# EAGLE design HoneyPI_Platine 2.01 (EAGLE 9.6.2)
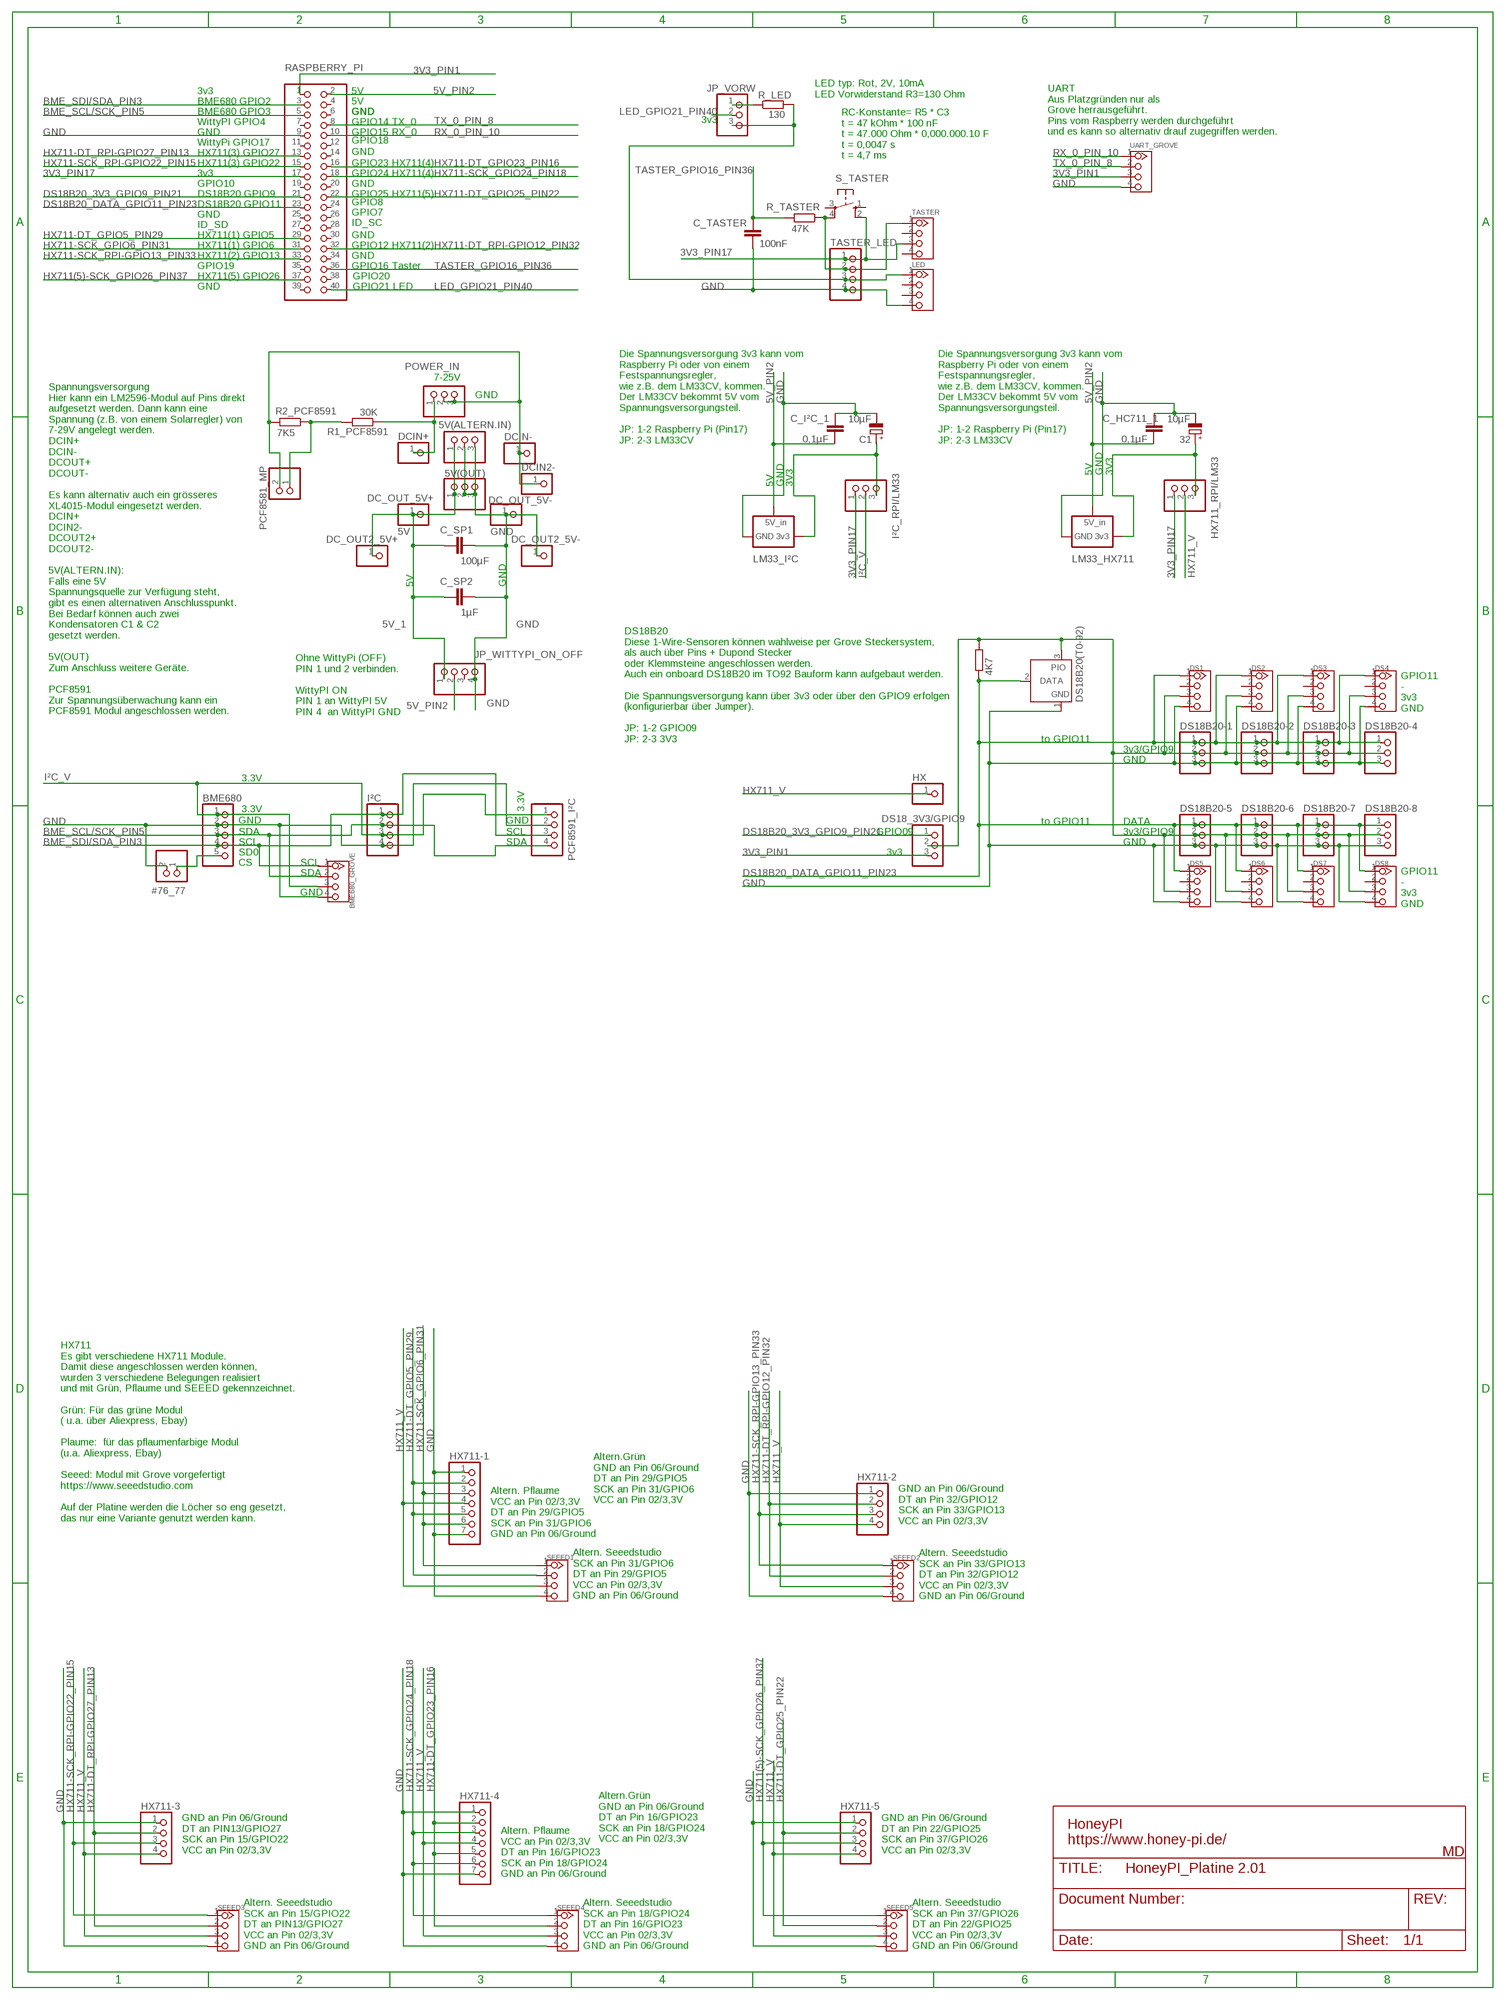
[diagram p0: schematic, sheet 1]

## Parts
5V(ALTERN.IN)  PINHD-1X3  [1X03]
5V(OUT)  PINHD-1X3  [1X03]
32  10µF  CPOL-EUE2-5  [E2-5]
#76_77  PINHD-1X2  [1X02]
BME680  PINHD-1X5  [1X05]
BME680_GROVE  TWIG-4P-2.0-2.0  [4P-2.0]
C1  10µF  CPOL-EUE2-5  [E2-5]
C_HC711_1  0,1µF  C2,5-3  [C2.5-3]
C_I²C_1  0,1µF  C2,5-3  [C2.5-3]
C_SP1  100µF  C2,5-3  [C2.5-3]
C_SP2  1µF  C2,5-3  [C2.5-3]
C_TASTER  100nF  C2,5-3  [C2.5-3]
DC_OUT2_5V+  PINHD-1X1  [1X01]
DC_OUT2_5V-  PINHD-1X1  [1X01]
DC_OUT_5V+  5V  PINHD-1X1  [1X01]
DC_OUT_5V-  GND  PINHD-1X1  [1X01]
DCIN2-  PINHD-1X1  [1X01]
DCIN+  PINHD-1X1  [1X01]
DCIN-  PINHD-1X1  [1X01]
DS1  TWIG-4P-2.0-2.0  [4P-2.0]
DS2  TWIG-4P-2.0-2.0  [4P-2.0]
DS3  TWIG-4P-2.0-2.0  [4P-2.0]
DS4  TWIG-4P-2.0-2.0  [4P-2.0]
DS5  TWIG-4P-2.0-2.0  [4P-2.0]
DS6  TWIG-4P-2.0-2.0  [4P-2.0]
DS7  TWIG-4P-2.0-2.0  [4P-2.0]
DS8  TWIG-4P-2.0-2.0  [4P-2.0]
DS18_3V3/GPIO9  PINHD-1X3  [1X03]
DS18B20(T0-92)  DS18b20  DS2405  [TO92-]
DS18B20-1  PINHD-1X3  [1X03]
DS18B20-2  PINHD-1X3  [1X03]
DS18B20-3  PINHD-1X3  [1X03]
DS18B20-4  PINHD-1X3  [1X03]
DS18B20-5  PINHD-1X3  [1X03]
DS18B20-6  PINHD-1X3  [1X03]
DS18B20-7  PINHD-1X3  [1X03]
DS18B20-8  PINHD-1X3  [1X03]
HX  PINHD-1X1  [1X01]
HX711-1  PINHD-1X7  [1X07]
HX711-2  PINHD-1X4  [1X04]
HX711-3  PINHD-1X4  [1X04]
HX711-4  PINHD-1X7  [1X07]
HX711-5  PINHD-1X4  [1X04]
HX711_RPI/LM33  PINHD-1X3  [1X03]
I²C  PINHD-1X4  [1X04]
I²C_RPI/LM33  PINHD-1X3  [1X03]
JP_VORW  PINHD-1X3  [1X03]
JP_WITTYPI_ON_OFF  PINHD-1X4  [1X04]
LED  TWIG-4P-2.0-2.0  [4P-2.0]
LM33_HX711  LM33CV  [337TS]
LM33_I²C  LM33CV  [337TS]
PCF8581_MP  PINHD-1X2  [1X02]
PCF8591_I²C  PINHD-1X4  [1X04]
POWER_IN  PINHD-1X3  [1X03]
R1_PCF8591  30K  R-EU_0204/7  [0204/7]
R2_PCF8591  7K5  R-EU_0204/7  [0204/7]
R_DS18B20  4K7  R-EU_0204/7  [0204/7]
R_LED  130  R-EU_0204/7  [0204/7]
R_TASTER  47K  R-EU_0204/7  [0204/7]
RASPBERRY_PI  PINHD-2X20  [2X20]
S_TASTER  10-XX  [B3F-10XX]
SEEED1  TWIG-4P-2.0-2.0  [4P-2.0]
SEEED2  TWIG-4P-2.0-2.0  [4P-2.0]
SEEED3  TWIG-4P-2.0-2.0  [4P-2.0]
SEEED4  TWIG-4P-2.0-2.0  [4P-2.0]
SEEED5  TWIG-4P-2.0-2.0  [4P-2.0]
TASTER  TWIG-4P-2.0-2.0  [4P-2.0]
TASTER_LED  PINHD-1X4  [1X04]
UART_GROVE  TWIG-4P-2.0-2.0  [4P-2.0]

## Nets
3V3 [Supply3v3]: DS1.3 DS2.3 DS3.3 DS4.3 DS5.3 DS6.3 DS7.3 DS8.3 DS18_3V3/GPIO9.2 DS18B20(T0-92).3(PIO) DS18B20-1.2 DS18B20-2.2 DS18B20-3.2 DS18B20-4.2 DS18B20-5.2 DS18B20-6.2 DS18B20-7.2 DS18B20-8.2 R_DS18B20.2
3V3_PIN1 [Supply3v3]: DS18_3V3/GPIO9.3 RASPBERRY_PI.1 UART_GROVE.3
3V3_PIN17 [Supply3v3]: HX711_RPI/LM33.1 I²C_RPI/LM33.1 RASPBERRY_PI.17 S_TASTER.2(S1) TASTER.3 TASTER_LED.1
5V_1 [Supply5v]: 5V(ALTERN.IN).1 5V(OUT).1 C_SP1.1 C_SP2.1 DC_OUT2_5V+.1 DC_OUT_5V+.1 JP_WITTYPI_ON_OFF.1
5V_PIN2 [Supply5v]: C_HC711_1.1 C_I²C_1.1 JP_WITTYPI_ON_OFF.2 LM33_HX711.1(5V) LM33_I²C.1(5V) RASPBERRY_PI.2
BME_SCL/SCK_PIN5: BME680.3 BME680_GROVE.2 I²C.2 PCF8591_I²C.4 RASPBERRY_PI.5
BME_SDI/SDA_PIN3: BME680.4 BME680_GROVE.1 I²C.1 PCF8591_I²C.3 RASPBERRY_PI.3
DS18B20_3V3_GPIO9_PIN21 [Supply3v3]: DS18_3V3/GPIO9.1 RASPBERRY_PI.21
DS18B20_DATA_GPIO11_PIN23: DS1.1 DS2.1 DS3.1 DS4.1 DS5.1 DS6.1 DS7.1 DS8.1 DS18B20(T0-92).2(DATA) DS18B20-1.1 DS18B20-2.1 DS18B20-3.1 DS18B20-4.1 DS18B20-5.1 DS18B20-6.1 DS18B20-7.1 DS18B20-8.1 R_DS18B20.1 RASPBERRY_PI.23
GND [Supply5v]: 5V(ALTERN.IN).2 5V(ALTERN.IN).3 5V(OUT).2 5V(OUT).3 32.- #76_77.2 BME680.2 BME680_GROVE.4 C1.- C_HC711_1.2 C_I²C_1.2 C_SP1.2 C_SP2.2 C_TASTER.1 DC_OUT2_5V-.1 DC_OUT_5V-.1 DS1.4 DS2.4 DS3.4 DS4.4 DS5.4 DS6.4 DS7.4 DS8.4 DS18B20(T0-92).1(GND) DS18B20-1.3 DS18B20-2.3 DS18B20-3.3 DS18B20-4.3 DS18B20-5.3 DS18B20-6.3 DS18B20-7.3 DS18B20-8.3 HX711-1.1 HX711-1.7 HX711-2.1 HX711-3.1 HX711-4.1 HX711-4.7 HX711-5.1 I²C.4 JP_WITTYPI_ON_OFF.4 LED.4 LM33_HX711.2(GND) LM33_I²C.2(GND) PCF8591_I²C.2 RASPBERRY_PI.9 SEEED1.4 SEEED2.4 SEEED3.4 SEEED4.4 SEEED5.4 TASTER_LED.4 UART_GROVE.4
HX711(5)-SCK_GPIO26_PIN37: HX711-5.3 RASPBERRY_PI.37 SEEED5.1
HX711-DT_GPIO5_PIN29: HX711-1.2 HX711-1.5 RASPBERRY_PI.29 SEEED1.2
HX711-DT_GPIO23_PIN16: HX711-4.2 HX711-4.5 RASPBERRY_PI.16 SEEED4.2
HX711-DT_GPIO25_PIN22: HX711-5.2 RASPBERRY_PI.22 SEEED5.2
HX711-DT_RPI-GPIO12_PIN32: HX711-2.2 RASPBERRY_PI.32 SEEED2.2
HX711-DT_RPI-GPIO27_PIN13: HX711-3.2 RASPBERRY_PI.13 SEEED3.2
HX711-SCK_GPIO6_PIN31: HX711-1.3 HX711-1.6 RASPBERRY_PI.31 SEEED1.1
HX711-SCK_GPIO24_PIN18: HX711-4.3 HX711-4.6 RASPBERRY_PI.18 SEEED4.1
HX711-SCK_RPI-GPIO13_PIN33: HX711-2.3 RASPBERRY_PI.33 SEEED2.1
HX711-SCK_RPI-GPIO22_PIN15: HX711-3.3 RASPBERRY_PI.15 SEEED3.1
HX711_V [Supply5v]: HX711-1.4 HX711-2.4 HX711-3.4 HX711-4.4 HX711-5.4 HX711_RPI/LM33.2 HX.1 SEEED1.3 SEEED2.3 SEEED3.3 SEEED4.3 SEEED5.3
I²C_V [Supply3v3]: BME680.1 BME680_GROVE.3 I²C.3 I²C_RPI/LM33.2 PCF8591_I²C.1
LED_2: JP_VORW.3 LED.1 R_LED.2 TASTER_LED.3
LED_GPIO21_PIN40 [Supply3v3]: JP_VORW.2 RASPBERRY_PI.40
N$1: DCIN2-.1 DCIN-.1 PCF8581_MP.2 POWER_IN.2 POWER_IN.3 R2_PCF8591.2
N$2: C1.+ I²C_RPI/LM33.3 LM33_I²C.3(OUT3V3)
N$3: R_TASTER.1 S_TASTER.4(P1) TASTER.1 TASTER_LED.2
N$4: 32.+ HX711_RPI/LM33.3 LM33_HX711.3(OUT3V3)
N$6: PCF8581_MP.1 R1_PCF8591.2 R2_PCF8591.1
N$8: #76_77.1 BME680.5
N$10: JP_VORW.1 R_LED.1
N$45 [Supply5v]: DCIN+.1 POWER_IN.1 R1_PCF8591.1
RX_0_PIN_10: RASPBERRY_PI.10 UART_GROVE.1
TASTER_GPIO16_PIN36: C_TASTER.2 R_TASTER.2 RASPBERRY_PI.36
TX_0_PIN_8: RASPBERRY_PI.8 UART_GROVE.2
Unconnected: DS1.2 DS2.2 DS3.2 DS4.2 DS5.2 DS6.2 DS7.2 DS8.2 JP_WITTYPI_ON_OFF.3 LED.2 LED.3 RASPBERRY_PI.4 RASPBERRY_PI.6 RASPBERRY_PI.7 RASPBERRY_PI.11 RASPBERRY_PI.12 RASPBERRY_PI.14 RASPBERRY_PI.19 RASPBERRY_PI.20 RASPBERRY_PI.24 RASPBERRY_PI.25 RASPBERRY_PI.26 RASPBERRY_PI.27 RASPBERRY_PI.28 RASPBERRY_PI.30 RASPBERRY_PI.34 RASPBERRY_PI.35 RASPBERRY_PI.38 RASPBERRY_PI.39 S_TASTER.1(S) S_TASTER.3(P) TASTER.2 TASTER.4

## Notes on the sheet
- 3v3 | 5V
- LED typ: Rot, 2V, 10mA
  LED Vorwiderstand R3=130 Ohm
- BME680 GPIO2 | 5V
- BME680 GPIO3 | GND | GND
- WittyPI GPIO4 | GPIO14 TX_0 | 3v3
- GND | GPIO15 RX_0
- WittyPi GPIO17 | GPIO18
- UART
  Aus Platzgründen nur als
  Grove herrausgeführt. 
  Pins vom Raspberry werden durchgeführt
  und es kann so alternativ drauf zugegriffen werden.
- HX711(3) GPIO27 | GND
- HX711(3) GPIO22 | GPIO23 HX711(4)
- RC-Konstante= R5 * C3
  t = 47 kOhm * 100 nF    
  t = 47.000 Ohm * 0,000.000.10 F
  t = 0,0047 s
  t = 4,7 ms
- 3v3 | GPIO24 HX711(4)
- GPIO10 | GND
- DS18B20 GPIO9 | GPIO25 HX711(5)
- DS18B20 GPIO11 | GPIO8
- GND | GPIO7
- ID_SD | ID_SC
- HX711(1) GPIO5 | GND
- HX711(1) GPIO6 | GPIO12 HX711(2)
- HX711(2) GPIO13 | GND
- GPIO19 | GPIO16 Taster
- HX711(5) GPIO26 | GPIO20
- GND | GPIO21 LED
- 7-25V
- GND
- Die Spannungsversorgung 3v3 kann vom
  Raspberry Pi oder von einem 
  Festspannungsregler, 
  wie z.B. dem LM33CV, kommen.
  Der LM33CV bekommt 5V vom
  Spannungsversorgungsteil.
  
  JP: 1-2 Raspberry Pi (Pin17)
  JP: 2-3 LM33CV
- Die Spannungsversorgung 3v3 kann vom
  Raspberry Pi oder von einem 
  Festspannungsregler, 
  wie z.B. dem LM33CV, kommen.
  Der LM33CV bekommt 5V vom
  Spannungsversorgungsteil.
  
  JP: 1-2 Raspberry Pi (Pin17)
  JP: 2-3 LM33CV
- 5V | GND | 3V3
- 5V | GND | 3V3
- 5V | GND
- GPIO11
  -
  3v3
  GND
- Spannungsversorgung
  Hier kann ein LM2596-Modul auf Pins direkt
  aufgesetzt werden. Dann kann eine
  Spannung (z.B. von einem Solarregler) von
  7-29V angelegt werden.
  DCIN+
  DCIN-
  DCOUT+
  DCOUT-
  
  Es kann alternativ auch ein grösseres
  XL4015-Modul eingesetzt werden. 
  DCIN+
  DCIN2-
  DCOUT2+
  DCOUT2-
  
  5V(ALTERN.IN):
  Falls eine 5V
  Spannungsquelle zur Verfügung steht,
  gibt es einen alternativen Anschlusspunkt.
  Bei Bedarf können auch zwei
  Kondensatoren C1 & C2
  gesetzt werden.    
  
  5V(OUT)
  Zum Anschluss weitere Geräte.
  
  PCF8591
  Zur Spannungsüberwachung kann ein
  PCF8591 Modul angeschlossen werden.
- Ohne WittyPi (OFF)
  PIN 1 und 2 verbinden.
  
  WittyPI ON
  PIN 1 an WittyPI 5V 
  PIN 4  an WittyPI GND
- DS18B20
  Diese 1-Wire-Sensoren können wahlweise per Grove Steckersystem,
  als auch über Pins + Dupond Stecker
  oder Klemmsteine angeschlossen werden.
  Auch ein onboard DS18B20 im TO92 Bauform kann aufgebaut werden. 
  
  Die Spannungsversorgung kann über 3v3 oder über den GPIO9 erfolgen
  (konfigurierbar über Jumper).
  
  JP: 1-2 GPIO09
  JP: 2-3 3V3
- to GPIO11
- 3v3/GPIO9
- GND
- 3.3V
- 3.3V | 3.3V
- GND | GND | to GPIO11 | DATA
- SDA | SCL | GPIO09 | 3v3/GPIO9
- SCL | SDA | GND
- SD0 | 3v3
- CS | SCL
- SDA
- GND
- GPIO11
  -
  3v3
  GND
- Altern.Grün
  GND an Pin 06/Ground
  DT an Pin 29/GPIO5
  SCK an Pin 31/GPIO6
  VCC an Pin 02/3,3V
- HX711
  Es gibt verschiedene HX711 Module.
  Damit diese angeschlossen werden können,
  wurden 3 verschiedene Belegungen realisiert
  und mit Grün, Pflaume und SEEED gekennzeichnet.
  
  Grün: Für das grüne Modul 
  ( u.a. über Aliexpress, Ebay)
  
  Plaume:  für das pflaumenfarbige Modul 
  (u.a. Aliexpress, Ebay) 
  
  Seeed: Modul mit Grove vorgefertigt
  https://www.seeedstudio.com
  
  Auf der Platine werden die Löcher so eng gesetzt,
  das nur eine Variante genutzt werden kann.
- GND an Pin 06/Ground
  DT an Pin 32/GPIO12
  SCK an Pin 33/GPIO13
  VCC an Pin 02/3,3V
- Altern. Pflaume
  VCC an Pin 02/3,3V
  DT an Pin 29/GPIO5
  SCK an Pin 31/GPIO6
  GND an Pin 06/Ground
- Altern. Seeedstudio
  SCK an Pin 31/GPIO6
  DT an Pin 29/GPIO5
  VCC an Pin 02/3,3V
  GND an Pin 06/Ground
- Altern. Seeedstudio
  SCK an Pin 33/GPIO13
  DT an Pin 32/GPIO12
  VCC an Pin 02/3,3V
  GND an Pin 06/Ground
- Altern.Grün
  GND an Pin 06/Ground
  DT an Pin 16/GPIO23
  SCK an Pin 18/GPIO24
  VCC an Pin 02/3,3V
- HoneyPI
  https://www.honey-pi.de/
- GND an Pin 06/Ground
  DT an PIN13/GPIO27
  SCK an Pin 15/GPIO22
  VCC an Pin 02/3,3V
- GND an Pin 06/Ground
  DT an Pin 22/GPIO25
  SCK an Pin 37/GPIO26
  VCC an Pin 02/3,3V
- MD
- Altern. Pflaume
  VCC an Pin 02/3,3V
  DT an Pin 16/GPIO23
  SCK an Pin 18/GPIO24
  GND an Pin 06/Ground
- Altern. Seeedstudio
  SCK an Pin 15/GPIO22
  DT an PIN13/GPIO27
  VCC an Pin 02/3,3V
  GND an Pin 06/Ground
- Altern. Seeedstudio
  SCK an Pin 18/GPIO24
  DT an Pin 16/GPIO23
  VCC an Pin 02/3,3V
  GND an Pin 06/Ground
- Altern. Seeedstudio
  SCK an Pin 37/GPIO26
  DT an Pin 22/GPIO25
  VCC an Pin 02/3,3V
  GND an Pin 06/Ground

## Library data of the parts
5V(ALTERN.IN) 5V(OUT) DS18_3V3/GPIO9 DS18B20-1-DS18B20-8 HX711_RPI/LM33 I²C_RPI/LM33 JP_VORW POWER_IN = pinhead:PINHD-1X3: PIN HEADER
32 C1 = rcl:CPOL-EU: POLARIZED CAPACITOR, European symbol; SPICEPREFIX: C
#76_77 PCF8581_MP = pinhead:PINHD-1X2: PIN HEADER
BME680 = pinhead:PINHD-1X5: PIN HEADER
BME680_GROVE DS1-DS8 LED SEEED1-SEEED5 TASTER UART_GROVE = Connector:TWIG-4P-2.0: Grove Stecker RM 2mm 4Pol
C_HC711_1 C_I²C_1 C_SP1 C_SP2 C_TASTER = capacitor-wima:C: CAPACITOR
DC_OUT2_5V+ DC_OUT2_5V- DC_OUT_5V+ DC_OUT_5V- DCIN2- DCIN+ DCIN- HX = pinhead:PINHD-1X1: PIN HEADER
DS18B20(T0-92) = maxim:DS2405: Addressable Switch DALLAS Semiconductor; MF: DALLAS SEMICONDUCTOR; MPN: DS2405; OC_FARNELL: 1188025; OC_NEWARK: 06F4645
HX711-1 HX711-4 = pinhead:PINHD-1X7: PIN HEADER
HX711-2 HX711-3 HX711-5 I²C JP_WITTYPI_ON_OFF PCF8591_I²C TASTER_LED = pinhead:PINHD-1X4: PIN HEADER
LM33_HX711 LM33_I²C = LM33cv:LM33CV: VOLTAGE REGULATOR
R1_PCF8591 R2_PCF8591 R_DS18B20 R_LED R_TASTER = rcl:R-EU_: RESISTOR, European symbol; SPICEPREFIX: R
RASPBERRY_PI = pinhead:PINHD-2X20: PIN HEADER
S_TASTER = switch-omron:10-XX: OMRON SWITCH; MPN: B3F-1000; OC_FARNELL: 176432; OC_NEWARK: 36M3542

## Net classes
0 Signal: width 0.152 mm, clearance 0.305 mm
1 Supply3v3: width 0.203 mm, clearance 0.305 mm
2 Supply5v: width 0.406 mm, clearance 0.305 mm

## Board
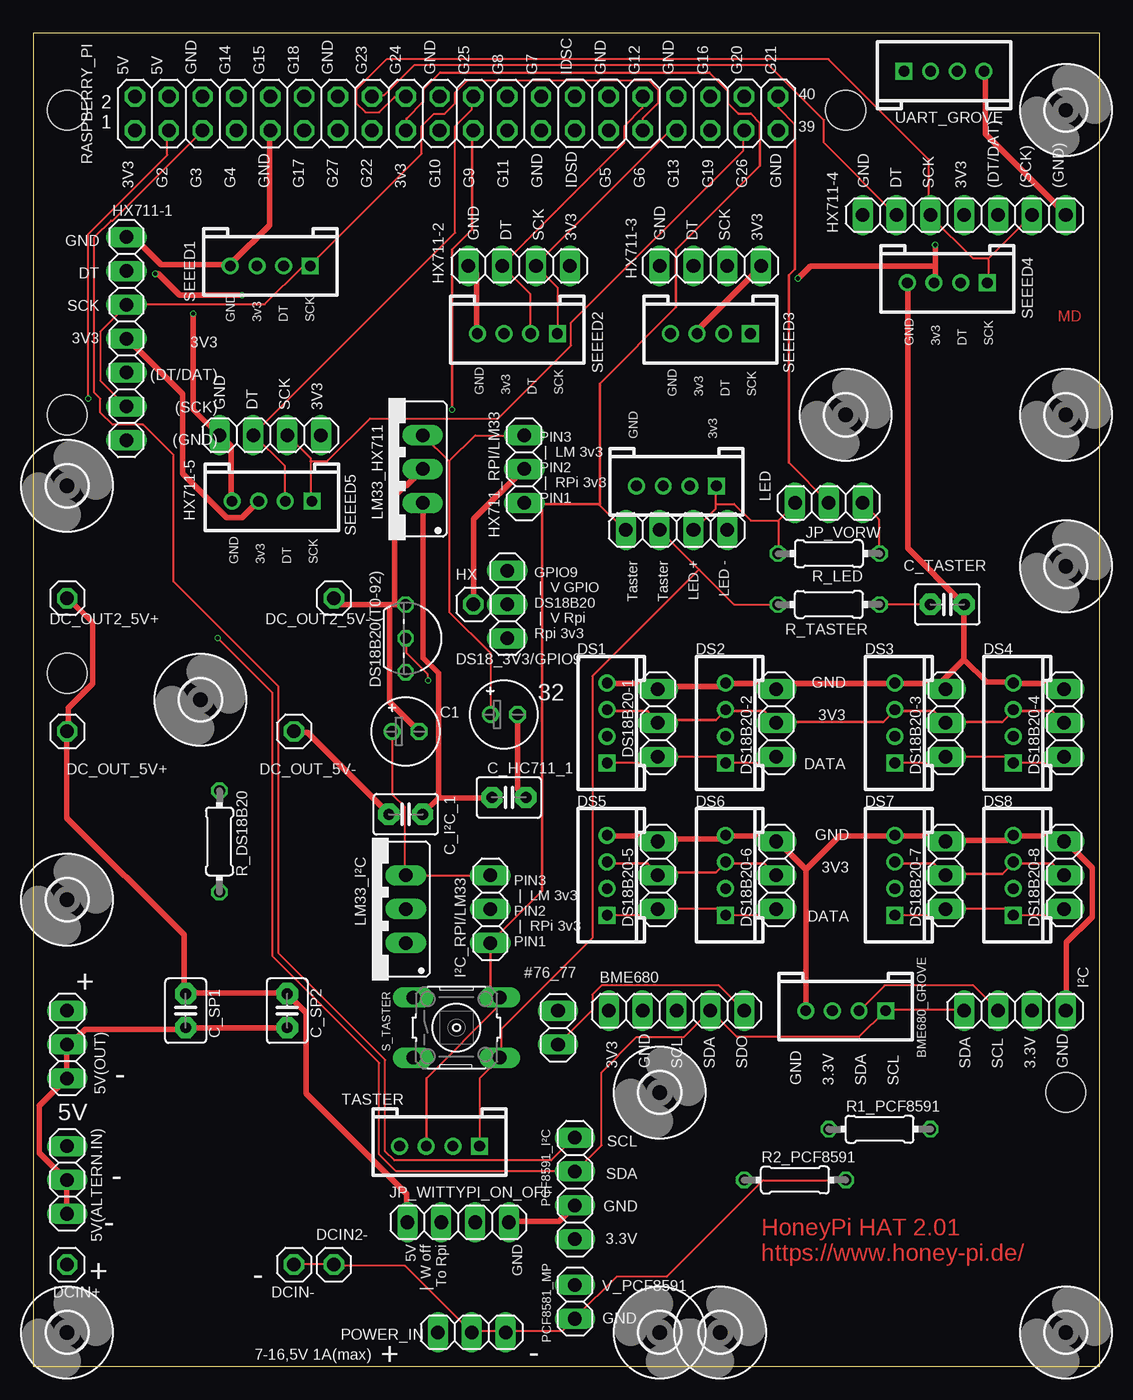
[diagram p1: board, top side]
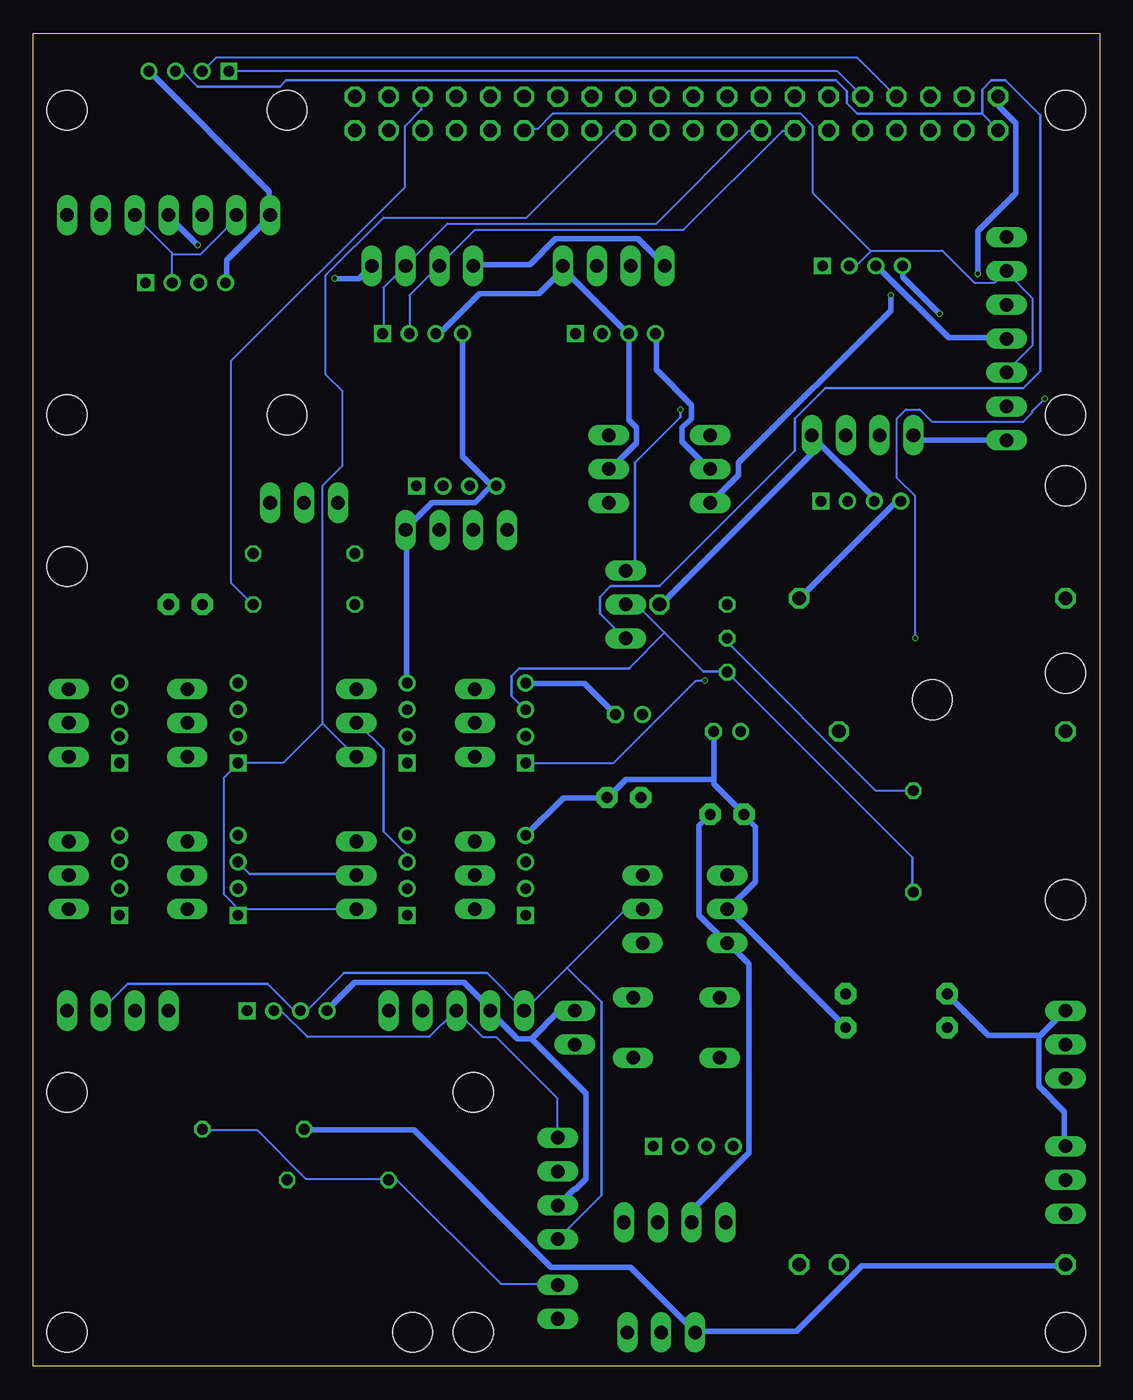
[diagram p2: board, bottom side, seen from below]

Size 80 x 100 mm. Coordinates in mm from the lower left corner, seen from the top.
Outline: 0,0 80,0 80,100 0,100 0,0
Copper layers (1*16): Top 0.035559375mm / dielectric 1.6mm / Bottom 0.035559375mm
Design rules "jlcpcb2layer": minimum track width 5mil, minimum drill 12mil, track to track 5mil, track to pad 5mil, pad to pad 5mil, via to via 5mil, smd to smd 5mil, copper to edge 8mil, drill to drill 6mil, minimum pad ring 5mil, minimum via ring 3mil, stop-mask expansion 2.5mil, vias tented up to drill 0mil, thermal gap 10mil
Holes 3 mm at 2.54,94.23 2.54,71.37 60.96,94.23 77.47,20.54 2.54,52

### Footprints (pad centres in the part's own frame; a part is rotated, then mirrored left to right if it is on the bottom)
1X03 = drill 1.016 long: 1 -2.54,0; 2 0,0; 3 2.54,0
E2-5 = drill 0.813 pad 1.27: + -1.016,0 | drill 0.813 pad 1.27 octagon: - 1.016,0
1X02 = drill 1.016 long: 1 -1.27,0; 2 1.27,0
1X05 = drill 1.016 long: 1 -5.08,0; 2 -2.54,0; 3 0,0; 4 2.54,0; 5 5.08,0
4P-2.0 = drill 0.8 pad 1.27 square: 1 -3,0 | drill 0.8 pad 1.27: 2 -1,0; 3 1,0; 4 3,0
C2.5-3 = drill 0.813 pad 1.6 octagon: 1 -1.27,0; 2 1.27,0
1X01 = drill 1.016 octagon: 1 0,0
TO92- = drill 0.813 octagon: 1 -2.54,0; 2 0,0; 3 2.54,0
1X07 = drill 1.016 long: 1 -7.62,0; 2 -5.08,0; 3 -2.54,0; 4 0,0; 5 2.54,0; 6 5.08,0; 7 7.62,0
1X04 = drill 1.016 long: 1 -3.81,0; 2 -1.27,0; 3 1.27,0; 4 3.81,0
337TS = drill 1.016 long: 1 -2.54,-2.54; 2 0,-2.54; 3 2.54,-2.54
0204/7 = drill 0.813 octagon: 1 -3.81,0; 2 3.81,0
2X20 = drill 1.016 octagon: 1 -24.13,-1.27; 2 -24.13,1.27; 3 -21.59,-1.27; 4 -21.59,1.27; 5 -19.05,-1.27; 6 -19.05,1.27; 7 -16.51,-1.27; 8 -16.51,1.27; 9 -13.97,-1.27; 10 -13.97,1.27; 11 -11.43,-1.27; 12 -11.43,1.27; 13 -8.89,-1.27; 14 -8.89,1.27; 15 -6.35,-1.27; 16 -6.35,1.27; 17 -3.81,-1.27; 18 -3.81,1.27; 19 -1.27,-1.27; 20 -1.27,1.27; 21 1.27,-1.27; 22 1.27,1.27; 23 3.81,-1.27; 24 3.81,1.27; 25 6.35,-1.27; 26 6.35,1.27; 27 8.89,-1.27; 28 8.89,1.27; 29 11.43,-1.27; 30 11.43,1.27; 31 13.97,-1.27; 32 13.97,1.27; 33 16.51,-1.27; 34 16.51,1.27; 35 19.05,-1.27; 36 19.05,1.27; 37 21.59,-1.27; 38 21.59,1.27; 39 24.13,-1.27; 40 24.13,1.27
B3F-10XX = drill 1.016 long: 1 -3.251,2.261; 2 3.251,2.261; 3 -3.251,-2.261; 4 3.251,-2.261
3,0 = hole 3: 0,0

### Placement (x,y rotation side)
5V(ALTERN.IN)  2.54,13.97 270 top
5V(OUT)  2.54,24.13 270 top
32  35.31,48.9 0 top
#76_77  39.37,25.4 90 top
BME680  48.26,26.67 0 top
BME680_GROVE  60.96,26.67 180 top
C1  27.94,47.62 0 top
C_HC711_1  35.69,42.67 0 top
C_I²C_1  27.94,41.4 180 top
C_SP1  11.43,26.67 270 top
C_SP2  19.05,26.67 270 top
C_TASTER  68.58,57.15 180 top
DC_OUT2_5V+  2.54,57.62 0 top
DC_OUT2_5V-  22.54,57.62 0 top
DC_OUT_5V+  2.54,47.62 0 top
DC_OUT_5V-  19.56,47.62 0 top
DCIN2-  22.54,7.62 0 top
DCIN+  2.54,7.62 0 top
DCIN-  19.56,7.62 0 top
DS1  43.05,48.26 90 top
DS2  51.94,48.26 90 top
DS3  64.64,48.26 90 top
DS4  73.53,48.26 90 top
DS5  43.05,36.83 90 top
DS6  51.94,36.83 90 top
DS7  64.64,36.83 90 top
DS8  73.53,36.83 90 top
DS18_3V3/GPIO9  35.56,57.15 270 top
DS18B20(T0-92)  27.94,54.61 270 top
DS18B20-1  46.86,48.26 90 top
DS18B20-2  55.75,48.26 90 top
DS18B20-3  68.45,48.26 90 top
DS18B20-4  77.34,48.26 90 top
DS18B20-5  46.86,36.83 90 top
DS18B20-6  55.75,36.83 90 top
DS18B20-7  68.45,36.83 90 top
DS18B20-8  77.34,36.83 90 top
HX  33.02,57.15 0 top
HX711-1  6.99,77.09 270 top
HX711-2  36.45,82.55 0 top
HX711-3  50.8,82.55 0 top
HX711-4  69.85,86.36 0 top
HX711-5  17.78,69.85 0 top
HX711_RPI/LM33  36.83,67.31 90 top
I²C  73.66,26.67 0 top
I²C_RPI/LM33  34.29,34.29 90 top
JP_VORW  59.69,64.77 180 top
JP_WITTYPI_ON_OFF  31.88,10.79 0 top
LED  48.26,66.04 180 top
LM33_HX711  26.67,67.31 90 top
LM33_I²C  25.4,34.29 90 top
PCF8581_MP  40.64,4.83 270 top
PCF8591_I²C  40.64,13.34 90 top
POWER_IN  32.89,2.54 0 top
R1_PCF8591  63.5,17.78 0 top
R2_PCF8591  57.15,13.97 0 top
R_DS18B20  13.97,39.37 270 top
R_LED  59.69,60.96 180 top
R_TASTER  59.69,57.15 0 top
RASPBERRY_PI  31.75,93.98 0 top
S_TASTER  31.75,25.4 0 top
SEEED1  17.78,82.55 180 top
SEEED2  36.32,77.47 180 top
SEEED3  50.8,77.47 180 top
SEEED4  68.58,81.28 180 top
SEEED5  17.91,64.9 180 top
TASTER  30.48,16.51 180 top
TASTER_LED  48.26,62.74 0 top
U$1  [3,0]  77.47,71.37 0 top
U$2  [3,0]  51.54,2.54 0 top
U$3  [3,0]  77.47,2.54 0 top
U$4  [3,0]  2.54,2.54 0 top
U$5  [3,0]  46.99,20.54 0 top
U$6  [3,0]  46.99,2.54 270 top
U$7  [3,0]  60.96,71.37 0 top
U$8  [3,0]  2.54,66.04 0 top
U$9  [3,0]  2.54,35 0 top
U$10  [3,0]  77.47,60 0 top
U$11  [3,0]  12.54,50 0 top
U$12  [3,0]  77.47,94.23 0 top
UART_GROVE  68.33,97.16 0 top

### Tracks (layer width: path | path; a pad name or v marks a point on that pad's centre or on a via)
3V3
  Top 0.203: DS5.3 43.09,37.72 46.06,37.72 46.86,36.92 DS18B20-5.2 46.86,37.03 51.21,37.03 51.89,37.72 DS6.3 52.01,37.72 54.86,37.72 DS18B20-6.2 | DS7.3 64.69,37.72 67.55,37.72 68.35,36.92 DS18B20-7.2 68.47,36.92 72.69,36.92 73.5,37.72 DS8.3 73.61,37.72 76.47,37.72 77.27,36.92 DS18B20-8.2 | DS1.3 43.09,49.15 46.06,49.15 46.86,48.35 DS18B20-1.2 46.86,48.46 51.21,48.46 51.89,49.15 DS2.3 52.01,49.15 54.86,49.15 DS18B20-2.2 55.78,48.35 63.78,48.35 64.58,49.15 DS3.3 64.69,49.15 67.55,49.15 68.35,48.35 DS18B20-3.2 68.47,48.35 72.69,48.35 73.5,49.15 DS4.3 73.61,49.15 76.47,49.15 77.27,48.35 DS18B20-4.2
  Bottom 0.203: R_DS18B20.2 14.06,35.66 14.06,38.18 27.89,52.01 DS18B20(T0-92).3 28,52.12 29.72,52.12 32.63,55.03 | DS18_3V3/GPIO9.2 34.75,57.15 32.63,55.03 | DS18B20-6.2 55.78,36.92 63.78,36.92 64.58,37.72 DS7.3 | DS6.3 52.01,37.83 52.01,38.41 53.72,40.12 53.72,46.29 55.66,48.23 DS18B20-2.2 | 32.63,55.03 35.32,52.35 43.55,52.35 44.12,51.78 44.12,50.29 43.09,49.26 DS1.3
3V3_PIN1
  Bottom 0.203: UART_GROVE.3 68.81,97.16 67.67,96.01 61.49,96.01 61.04,96.47 19.77,96.47 18.97,95.67 18.97,94.75 18.17,93.95 8.8,93.95 | 8.8,93.95 7.66,92.81 RASPBERRY_PI.1 | 8.8,93.95 8.8,95.78 8.12,96.47 7.09,96.47 4.46,93.84 4.46,74.64 5.71,73.38 20.57,73.38 22.86,71.09 22.86,68.69 33.03,58.52 36.69,58.52 37.49,57.72 37.49,56.46 35.66,54.63 DS18_3V3/GPIO9.3
3V3_PIN17
  Top 0.203: 34.98,27.66 34.98,27.09 29.49,21.6 29.49,16.57 TASTER.3 | 34.98,27.66 34.29,28.35 I²C_RPI/LM33.1 34.29,31.77 38.18,35.66 38.18,64.69 | 34.98,27.66 S_TASTER.2 | 38.18,64.69 42.41,64.69 42.46,64.64 | 38.18,64.69 36.92,64.69 HX711_RPI/LM33.1 38.18,64.69 | 42.46,64.64 44.35,62.75 TASTER_LED.1 | RASPBERRY_PI.17 28,92.81 28,93.61 29.26,94.87 29.26,95.78 30.52,97.04 50.75,97.04 52.12,95.67 52.12,94.75 52.92,93.95 53.84,93.95 54.52,93.27 54.52,90.07 48.23,83.78 48.23,79.44 42.52,73.72 42.52,64.69 42.46,64.64
5V_1
  Top 0.406: DC_OUT2_5V+.1 2.63,57.61 4.46,55.78 4.46,51.21 2.63,49.38 2.63,47.66 DC_OUT_5V+.1 2.52,47.43 2.52,41.15 11.32,32.35 11.32,28.12 C_SP1.1 11.43,28 18.86,28 C_SP2.1 19.09,27.89 20.46,26.52 20.46,20.46 28,12.92 28,10.86 JP_WITTYPI_ON_OFF.1
  Bottom 0.406: 4.57,24.69 4.57,21.03 2.63,19.09 2.63,16.57 5V(ALTERN.IN).1 | 4.57,24.69 2.63,26.63 5V(OUT).1 | 4.57,24.69 4.69,24.8 8.34,24.8 11.43,27.89 C_SP1.1
5V_PIN2  (via drill 0.3)
  Top 0.406: 30.4,42.63 30.4,52.01 29.26,53.15 29.26,64.69 LM33_HX711.1 | 30.4,42.63 29.26,41.49 C_I²C_1.1 | v9.14,81.95 9.37,81.95 10.97,80.35 v15.66,80.35 | 30.4,42.63 34.4,42.63 C_HC711_1.1
  Bottom 0.406: C_I²C_1.1 29.26,41.38 30.06,40.58 30.06,33.83 28,31.77 LM33_I²C.1 27.77,31.66 26.29,30.18 26.29,16 30.52,11.77 30.52,10.86 JP_WITTYPI_ON_OFF.2 | v9.14,81.95 9.14,85.15 6.29,88.01 6.29,93.27 7.54,94.53 7.54,95.21 RASPBERRY_PI.2 | v15.66,80.35 15.66,79.21 27.09,67.78 27.09,66.86 29.15,64.81 LM33_HX711.1
BME_SCL/SCK_PIN5
  Top 0.152: BME680_GROVE.2 62.06,26.75 63.89,28.57 70.52,28.57 72.35,26.75 I²C.2 | RASPBERRY_PI.5 5.94,85.95 5.83,85.95 4.57,84.7 4.57,73.04 5.03,72.58 5.03,71.55 5.94,70.64 8.23,70.64 10.52,68.35 10.52,58.86 18.4,50.98 18.4,30.98 26.4,22.97 26.4,16.12 27.09,15.43 38.86,15.43 40.58,17.14 PCF8591_I²C.4
  Bottom 0.152: PCF8591_I²C.4 40.69,17.14 40.69,20.12 45.26,24.69 46.29,24.69 48.23,26.63 BME680.3 48.35,26.63 50.29,24.69 59.44,24.69 61.38,26.63 61.95,26.63 BME680_GROVE.2
BME_SDI/SDA_PIN3  (via drill 0.3)
  Top 0.152: I²C.1 69.84,26.75 64.01,26.75 BME680_GROVE.1 63.89,26.63 61.95,24.69 52.81,24.69 50.86,26.63 BME680.4 50.75,26.63 48.81,24.69 45.26,24.69 42.63,22.06 42.63,16.57 40.69,14.63 PCF8591_I²C.3 40.58,14.63 27.2,14.63 25.95,15.89 25.95,22.75 17.95,30.75 17.95,50.52 v13.83,54.63 | v4.12,72.58 4.12,84.92 10.06,90.87 10.06,92.7 RASPBERRY_PI.3
  Bottom 0.152: v4.12,72.58 5.03,71.67 5.03,71.55 5.71,70.87 12.57,70.87 13.49,71.78 14.52,71.78 15.2,71.09 15.2,66.64 13.83,65.27 v13.83,54.63
DS18B20_3V3_GPIO9_PIN21  (via drill 0.3)
  Top 0.203: v31.43,71.78 31.43,83.78 32.92,85.27 32.92,92.7 RASPBERRY_PI.21
  Bottom 0.203: v31.43,71.78 31.43,71.21 34.86,67.78 34.86,60.47 35.55,59.78 DS18_3V3/GPIO9.1
DS18B20_DATA_GPIO11_PIN23  (via drill 0.3)
  Top 0.152: DS5.1 43.09,33.83 46.41,33.83 DS18B20-5.1 51.44,34.29 51.89,33.83 DS6.1 52.01,33.83 55.21,33.83 55.66,34.29 DS18B20-6.1 | DS7.1 64.69,33.83 67.89,33.83 68.35,34.29 DS18B20-7.1 73.04,34.29 73.5,33.83 DS8.1 73.61,33.83 76.81,33.83 77.27,34.29 DS18B20-8.1 | DS3.1 64.69,45.26 67.89,45.26 68.35,45.72 DS18B20-3.1 73.04,45.72 73.5,45.26 DS4.1 73.61,45.26 76.81,45.26 77.27,45.72 DS18B20-4.1 | DS1.1 43.09,45.26 46.41,45.26 DS18B20-1.1 51.44,45.72 51.89,45.26 DS2.1 52.01,45.26 55.21,45.26 55.66,45.72 DS18B20-2.1 | v29.6,51.44 29.6,51.89 28,53.49 28,54.52 DS18B20(T0-92).2
  Bottom 0.152: DS18B20-6.1 64.12,34.29 64.35,34.06 | 64.35,34.06 64.58,33.83 DS7.1 64.35,34.06 | R_DS18B20.1 14.06,43.2 16.8,43.2 27.89,54.29 27.89,54.52 DS18B20(T0-92).2 | 58.29,48.23 58.29,66.06 56.81,67.55 56.81,73.15 58.06,74.41 58.06,81.84 53.72,86.18 42.98,86.18 36.46,92.7 35.66,92.7 RASPBERRY_PI.23 | 58.29,48.23 55.78,45.72 DS18B20-2.1 | 58.29,48.23 61.27,45.26 64.58,45.26 DS3.1 64.69,45.15 65.72,44.12 65.72,35.43 64.35,34.06 | v29.6,51.44 30.29,51.44 36.46,45.26 42.98,45.26 DS1.1
GND  (via drill 0.3)
  Top 0.406: HX711-1.1 7.09,84.7 7.54,84.7 9.6,82.64 14.74,82.64 SEEED1.4 14.86,82.75 17.72,85.61 17.72,92.7 RASPBERRY_PI.9 | SEEED2.4 33.26,77.5 33.26,81.95 32.69,82.53 HX711-2.1 | SEEED5.4 14.86,64.92 14.86,69.04 14.06,69.84 HX711-5.1 13.83,69.95 12,71.78 v12,78.98 | 26.75,57.15 23.09,57.15 22.63,57.61 DC_OUT2_5V-.1 | 26.75,57.15 27.09,57.15 | 27.09,57.15 DS18B20(T0-92).1 | 27.09,57.15 27.09,65.27 27.89,66.06 28,66.06 29.15,67.21 LM33_HX711.2 | C_SP2.2 18.97,25.38 11.43,25.38 C_SP1.2 11.32,25.26 3.89,25.26 2.74,24.12 5V(OUT).2 2.52,24.12 2.52,21.6 5V(OUT).3 2.4,21.49 0.46,19.55 0.46,16 2.4,14.06 5V(ALTERN.IN).2 2.52,13.95 2.52,11.43 5V(ALTERN.IN).3 | UART_GROVE.4 71.44,97.16 71.44,92.47 77.5,86.41 HX711-4.7 | PCF8591_I²C.2 39.43,10.86 35.78,10.86 JP_WITTYPI_ON_OFF.4 | I²C.4 77.5,26.75 77.5,31.77 79.44,33.72 79.44,37.38 77.5,39.32 DS18B20-8.3 77.27,39.43 76.92,39.78 73.61,39.78 DS8.4 73.38,39.78 73.04,39.43 68.58,39.43 DS18B20-7.3 68.35,39.43 68.01,39.78 64.69,39.78 DS7.4 64.47,39.78 60.47,39.78 57.95,37.26 | DC_OUT_5V-.1 19.66,47.55 20.57,47.55 26.63,41.49 C_I²C_1.2 | DS18B20-4.3 77.27,50.86 76.92,51.21 73.61,51.21 DS4.4 73.38,51.32 71.55,51.32 69.84,53.03 | 69.84,53.03 69.84,57.15 C_TASTER.1 69.72,57.26 65.61,61.38 65.61,81.27 SEEED4.4 | 69.84,53.03 68.12,51.32 DS18B20-3.3 68.35,50.86 68.01,51.21 64.69,51.21 DS3.4 64.47,51.21 56.24,51.21 55.89,50.86 DS18B20-2.3 55.66,50.86 55.32,51.21 52.01,51.21 DS2.4 51.78,51.21 51.55,50.98 46.98,50.98 DS18B20-1.3 46.86,50.86 46.52,51.21 43.09,51.21 DS1.4 | 32.- 36.35,48.81 36.35,43.32 36.92,42.75 C_HC711_1.2
  Top 0.406: DS5.4 43.09,39.78 46.52,39.78 46.86,39.43 DS18B20-5.3 46.98,39.55 51.55,39.55 51.78,39.78 DS6.4 52.01,39.78 55.32,39.78 55.66,39.43 DS18B20-6.3 55.89,39.32 57.95,37.26 | 57.95,37.26 57.95,26.75 BME680_GROVE.4 | 26.75,57.15 26.75,49.84 C1.-
  Bottom 0.406: HX711-3.1 46.98,82.64 42.75,82.64 40.8,84.58 34.63,84.58 32.69,82.64 HX711-2.1 | HX711-1.7 7.09,69.49 13.6,69.49 13.95,69.84 HX711-5.1 | SEEED5.4 14.97,64.81 15.32,64.81 22.52,57.61 DC_OUT2_5V-.1 | SEEED2.4 33.26,77.38 33.26,74.75 30.63,72.12 30.63,71.09 31.32,70.41 31.32,69.38 29.26,67.32 LM33_HX711.2 | v12,78.98 14.74,81.72 14.74,82.53 SEEED1.4 | SEEED4.4 65.49,81.38 65.49,82.98 62.18,86.3 HX711-4.1 62.29,86.53 62.29,88.12 UART_GROVE.4 | 42.63,24.57 40.58,26.63 39.43,26.63 #76_77.2 | 42.63,24.57 43.66,24.57 45.72,26.63 BME680.2 45.72,26.86 47.66,28.8 55.89,28.8 57.95,26.75 BME680_GROVE.4 | 42.63,24.57 38.52,20.46 38.52,14.06 39.32,13.26 39.43,13.26 40.58,12.12 PCF8591_I²C.2 | 28.92,44.01 28.92,43.66 26.75,41.49 C_I²C_1.2 26.63,41.26 25.83,40.46 25.83,36.35 27.89,34.29 LM33_I²C.2 27.77,34.18 19.09,25.49 C_SP2.2 | 28.92,44.01 28.92,47.55 C1.- | SEEED3.4 47.78,77.38 47.78,68.24 45.61,66.06 LED.4 45.26,65.95 45.72,65.95 46.86,64.81 50.06,64.81 52.12,62.75 TASTER_LED.4 52.01,62.64 52.01,51.32 DS2.4 | DS5.4 42.98,39.89 40.23,42.63 37.03,42.63 C_HC711_1.2 36.8,42.75 35.55,44.01 28.92,44.01 | 32.- 38.63,51.21 42.98,51.21 DS1.4
HX711(5)-SCK_GPIO26_PIN37
  Top 0.152: 20.8,67.89 20.8,68.12 19.09,69.84 HX711-5.3 | 20.8,67.89 20.8,64.92 SEEED5.1 | 20.8,67.89 22.06,67.89 25.26,71.09 34.86,71.09 40.35,76.58 40.35,78.3 53.26,91.21 53.26,92.7 RASPBERRY_PI.37
HX711-DT_GPIO5_PIN29
  Bottom 0.152: 17.14,83.67 18.17,82.64 18.75,82.64 SEEED1.2 | 17.14,83.67 11.77,83.67 9.37,81.27 7.89,81.27 HX711-1.2 6.97,82.07 5.03,80.12 5.03,76.58 6.97,74.64 HX711-1.5 | 17.14,83.67 21.49,88.01 21.49,93.04 22.4,93.95 41.03,93.95 42.18,92.81 43.09,92.81 RASPBERRY_PI.29
HX711-DT_GPIO23_PIN16
  Top 0.152: RASPBERRY_PI.16 25.49,95.33 26.29,95.33 28.57,97.61 55.21,97.61 59.32,93.5 59.32,91.78 64.69,86.41 HX711-4.2
  Bottom 0.152: 69.61,83.44 69.61,83.55 72.35,86.3 HX711-4.5 | 69.61,83.44 69.61,81.38 SEEED4.2 | 69.61,83.44 67.44,83.44 64.81,86.07 64.81,86.3 HX711-4.2
HX711-DT_GPIO25_PIN22
  Top 0.152: SEEED5.2 18.86,64.92 18.86,67.55 16.57,69.84 HX711-5.2 16.57,69.95 31.66,85.04 31.66,93.04 32.92,94.3 32.92,95.21 RASPBERRY_PI.22
HX711-DT_RPI-GPIO12_PIN32
  Top 0.152: SEEED2.2 37.26,77.5 37.26,80.47 HX711-2.2 35.2,82.64 44.35,91.78 44.35,93.04 45.72,94.41 RASPBERRY_PI.32
HX711-DT_RPI-GPIO27_PIN13
  Bottom 0.152: SEEED3.2 51.78,77.5 51.78,80.35 49.61,82.53 HX711-3.2 49.49,82.64 46.86,85.27 31.2,85.27 23.77,92.7 22.86,92.7 RASPBERRY_PI.13
HX711-SCK_GPIO6_PIN31
  Top 0.152: HX711-1.6 6.97,72.01 5.03,73.95 5.03,77.61 6.97,79.55 HX711-1.3 7.09,79.67 17.37,79.67 20.23,82.53 20.69,82.53 SEEED1.1 20.8,82.64 29.15,90.98 29.15,93.04 30.06,93.95 30.86,93.95 31.66,94.75 31.66,95.56 32.58,96.47 46.18,96.47 46.86,95.78 46.86,94.75 45.72,93.61 RASPBERRY_PI.31
HX711-SCK_GPIO24_PIN18
  Top 0.152: 71.67,83.1 71.67,81.38 SEEED4.1 | HX711-4.6 71.67,83.1 | 71.67,83.1 70.52,83.1 67.32,86.3 HX711-4.3 67.21,86.41 67.21,90.53 59.66,98.07 26.52,98.07 24.23,95.78 24.23,94.75 24.92,94.07 25.95,94.07 27.09,95.21 27.89,95.21 RASPBERRY_PI.18
HX711-SCK_RPI-GPIO13_PIN33
  Top 0.152: SEEED2.1 39.32,77.5 39.32,80.92 37.72,82.53 HX711-2.3 37.72,82.64 47.78,92.7 48.23,92.7 RASPBERRY_PI.33
HX711-SCK_RPI-GPIO22_PIN15
  Bottom 0.152: SEEED3.1 53.72,77.5 53.72,80.92 52.12,82.53 HX711-3.3 52.01,82.64 48.92,85.72 33.26,85.72 26.29,92.7 25.49,92.7 RASPBERRY_PI.15
HX711_V  (via drill 0.3)
  Top 0.406: v67.67,84.12 67.67,82.53 | 67.67,82.53 67.67,81.38 SEEED4.3 | SEEED3.3 49.84,77.5 49.84,77.72 54.63,82.53 HX711-3.4 | 67.67,82.53 58.29,82.53 v57.38,81.61 | HX.1 33.03,57.15 33.03,63.55 36.8,67.32 HX711_RPI/LM33.2 | HX711-1.4 7.09,77.04 11.2,72.92 11.2,66.98 14.52,63.66 15.66,63.66 16.8,64.81 SEEED5.3
  Bottom 0.406: v67.67,84.12 69.84,86.3 HX711-4.4 | v57.38,81.61 55.55,81.61 HX711-3.4 | SEEED1.3 16.69,82.53 11.32,77.15 7.09,77.15 HX711-1.4 | SEEED5.3 16.92,64.92 16.92,65.15 21.6,69.84 HX711-5.4 21.03,69.04 32.92,57.15 HX.1 | HX711_RPI/LM33.2 36.8,67.21 34.75,69.27 34.75,70.41 35.32,70.98 35.32,77.27 SEEED2.3 35.43,77.5 40.23,82.3 40.23,82.53 HX711-2.4 40.35,82.18 42.06,80.47 46.52,80.47 49.49,77.5 49.72,77.5 SEEED3.3
I²C_V
  Bottom 0.203: I²C.3 74.87,26.75 72.92,28.69 62.41,28.69 60.47,26.75 60.01,26.75 BME680_GROVE.3 59.89,26.75 59.44,26.75 56.69,29.49 45.95,29.49 43.2,26.75 BME680.1 43.09,26.75 39.95,29.89 | I²C_RPI/LM33.2 35.55,34.29 39.95,29.89 | 39.95,29.89 37.38,27.32 37.38,12.8 40.58,9.6 PCF8591_I²C.1
LED_2
  Top 0.152: 55.89,63.44 55.89,61.04 R_LED.2 | 55.89,63.44 57.15,64.69 JP_VORW.3 | 51.21,64.69 51.21,64.35 49.61,62.75 TASTER_LED.3 | 51.21,64.69 51.21,65.95 LED.1 | 55.89,63.44 53.84,63.44 52.58,64.69 51.21,64.69
LED_GPIO21_PIN40
  Top 0.203: RASPBERRY_PI.40 55.89,95.21 55.89,94.41 57.15,93.15 57.15,82.3 56.69,81.84 56.69,67.78 59.66,64.81 JP_VORW.2
N$1
  Top 0.152: DCIN-.1 19.66,7.66 22.52,7.66 DCIN2-.1 22.63,7.54 27.89,7.54 POWER_IN.2 32.92,2.63 35.43,2.63 | R2_PCF8591.2 60.92,13.95 54.75,13.95 47.55,6.74 43.78,6.74 40.69,3.66 PCF8581_MP.2 40.58,3.54 39.66,2.63 35.43,2.63 | 35.43,2.63 POWER_IN.3
N$2
  Top 0.152: C1.+ 26.98,47.55 26.98,42.86 27.89,41.95 27.89,36.92 LM33_I²C.3 28,36.8 34.29,36.8 I²C_RPI/LM33.3
N$3
  Top 0.152: TASTER.1 33.49,16.57 33.49,21.6 34.98,23.09 S_TASTER.4 35.09,23.2 35.09,25.26 41.95,32.12 41.95,51.78 49.95,59.78 | R_TASTER.1 52.58,57.15 49.95,59.78 | TASTER_LED.2 49.95,59.78
N$4
  Top 0.152: 32.+ 34.29,53.49 31.2,56.58 31.2,67.89 | 31.2,67.89 29.26,69.84 LM33_HX711.3 | 31.2,67.89 33.15,69.84 36.8,69.84 HX711_RPI/LM33.3
N$6
  Bottom 0.152: R1_PCF8591.2 67.21,17.72 63.21,17.72 59.55,14.06 53.38,14.06 R2_PCF8591.1 53.26,13.95 52.69,13.95 44.92,6.17 40.69,6.17 PCF8581_MP.1
N$8
  Top 0.152: BME680.5 51.44,28.57 42.63,28.57 41.95,27.89 41.95,26.75 39.43,24.23 #76_77.1
N$10
  Top 0.152: R_LED.1 63.44,61.04 63.44,63.55 62.29,64.69 JP_VORW.1
N$45
  Bottom 0.406: R1_PCF8591.1 59.66,17.72 51.44,17.72 41.15,7.43 35.2,7.43 30.4,2.63 POWER_IN.1 30.18,2.63 22.75,2.63 17.83,7.54 2.63,7.54 DCIN+.1
RX_0_PIN_10
  Bottom 0.152: UART_GROVE.1 19.66,97.16 17.83,95.33 RASPBERRY_PI.10
TASTER_GPIO16_PIN36
  Top 0.152: C_TASTER.2 R_TASTER.2
  Bottom 0.152: RASPBERRY_PI.36 50.86,95.21 50.86,94.3 52.12,93.04 52.12,88.47 65.15,75.44 65.15,58.75 63.55,57.15 R_TASTER.2
TX_0_PIN_8
  Bottom 0.152: RASPBERRY_PI.8 18.17,98.18 66.29,98.18 UART_GROVE.2

### Text on the board
Top: MD | HoneyPi HAT 2.01 / https://www.honey-pi.de/
tNames: 5V / / 5V / / GND / / G14 / / G15 / / G18 / / GND / / G23 / / G24 / / GND / / G25 / / G8 / / G7 / / IDSC / / GND / / G12 / / GND / / G16 / / G20 / / G21 | 2 / 1 | 40 / / 39 | 3V3 / / G2 / / G3 / / G4 / / GND / / G17 / / G27 / / G22 / / 3v3 / / G10 / / G9 / / G11 / / GND / / IDSD / / G5 / / G6 / / G13 / / G19 / / G26 / / GND | GND / / DT / / SCK / / 3V3 / / (DT/DAT) / / (SCK) / / (GND) | GND / / DT / / SCK / / 3V3 | GND / / DT / / SCK / / 3V3 | GND / / DT / / SCK / / 3V3 | GND / / 3v3 / / DT / / SCK | 3V3 / / (DT/DAT) / / (SCK) / / (GND) | GND / / 3v3 / / DT / / SCK | GND / / 3v3 / / DT / / SCK | GND / / 3v3 / / DT / / SCK | GND / / DT / / SCK / / 3V3 | GND / / / / / / 3v3 | PIN3 / | LM 3v3 / PIN2 / | RPi 3v3 / PIN1 | GND / / 3v3 / / DT / / SCK | Taster / / Taster / / LED + / / LED - | GPIO9 / | V GPIO / DS18B20 / | V Rpi / Rpi 3v3 | GND / / 3V3 / / / DATA | GND / / 3V3 / / / DATA | PIN3 / | LM 3v3 / PIN2 / | RPi 3v3 / PIN1 | + | 3V3 / / GND / / SCL / / SDA / / SDO | SDA / / SCL / / 3.3V / / GND | - | GND / / 3.3V / / SDA / / SCL | 5V | SCL / / SDA / / GND / / 3.3V | - | - | 5V / | W off / To Rpi / / / / / GND | + | - | V_PCF8591 / / GND | + | - | 7-16,5V 1A(max)